# EAGLE design rpi-display-5110 (EAGLE 7.7.0)
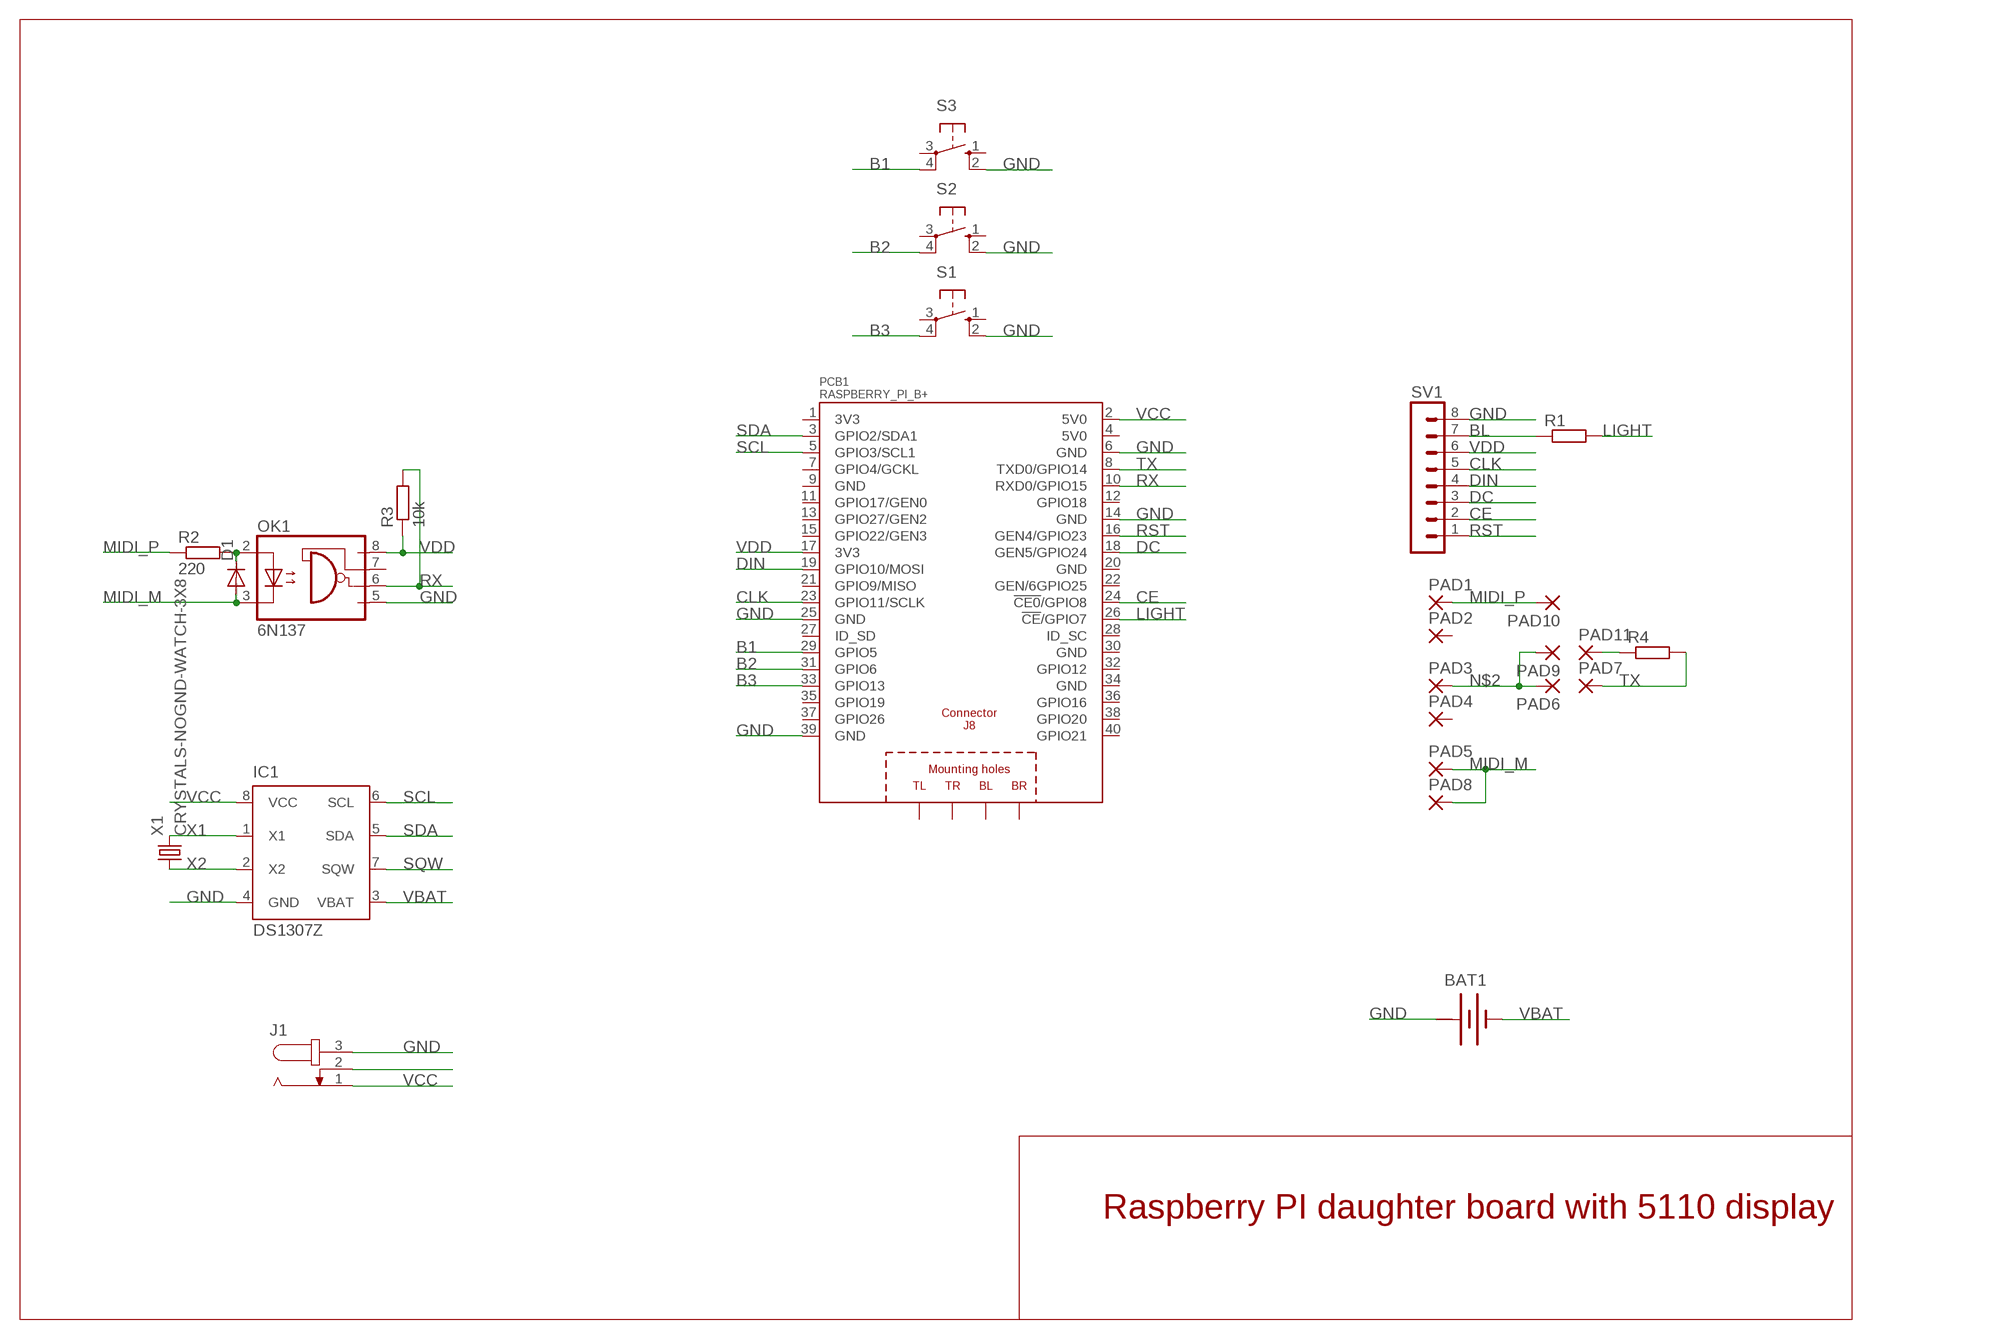
[diagram p0: schematic, sheet 1]

## Parts
BAT1  BATTERY  [BATTERY]
D1  DIODE-MINIMELF  [MINIMELF]
IC1  DS1307Z  [SOIC8]
J1  JACK-PLUG1  [SPC4078]
OK1  6N137  [DIL08]
PAD1  1,6/0,8  [1,6/0,8]
PAD2  1,6/0,8  [1,6/0,8]
PAD3  1,6/0,8  [1,6/0,8]
PAD4  1,6/0,8  [1,6/0,8]
PAD5  1,6/0,8  [1,6/0,8]
PAD6  1,6/0,8  [1,6/0,8]
PAD7  1,6/0,8  [1,6/0,8]
PAD8  1,6/0,8  [1,6/0,8]
PAD9  1,6/0,8  [1,6/0,8]
PAD10  1,6/0,8  [1,6/0,8]
PAD11  1,6/0,8  [1,6/0,8]
PCB1  RASPBERRY_PI_B+  [RASPBERRY_PI_B+]
R1  R-EU_R0805  [R0805]
R2  220  R-EU_R0805  [R0805]
R3  10k  R-EU_R0805  [R0805]
R4  R-EU_R0805  [R0805]
S1  10-XX  [B3F-10XX]
S2  10-XX  [B3F-10XX]
S3  10-XX  [B3F-10XX]
SV1  MA08-1  [MA08-1]
X1  CRYSTALS-NOGND-WATCH-3X8  [WATCH-3X8]

## Nets
B1: PCB1.29(GPIO5) S3.4(P1)
B2: PCB1.31(GPIO6) S2.4(P1)
B3: PCB1.33(GPIO13) S1.4(P1)
BL: R1.1 SV1.7
CE: PCB1.24(!CE0!/GPIO8) SV1.2
CLK: PCB1.23(GPIO11/SCLK) SV1.5
DC: PCB1.18(GEN5/GPIO24) SV1.3
DIN: PCB1.19(GPIO10/MOSI) SV1.4
GND: BAT1.+ IC1.4(GND) J1.3 OK1.5(GND) PCB1.6(GND) PCB1.14(GND) PCB1.25(GND) PCB1.39(GND) S1.2(S1) S2.2(S1) S3.2(S1) SV1.8
LIGHT: PCB1.26(!CE!/GPIO7) R1.2
MIDI_M: D1.A OK1.3(C) PAD5.1(P) PAD8.1(P)
MIDI_P: PAD1.1(P) PAD10.1(P) R2.1
N$1: D1.C OK1.2(A) R2.2
N$2: PAD3.1(P) PAD6.1(P) PAD9.1(P)
N$3: PAD11.1(P) R4.1
N$4: J1.2
RST: PCB1.16(GEN4/GPIO23) SV1.1
RX: OK1.6(VO) PCB1.10(RXD0/GPIO15) R3.2
SCL: IC1.6(SCL) PCB1.5(GPIO3/SCL1)
SDA: IC1.5(SDA) PCB1.3(GPIO2/SDA1)
SQW: IC1.7(SQW)
TX: PAD7.1(P) PCB1.8(TXD0/GPIO14) R4.2
VBAT: BAT1.- IC1.3(VBAT)
VCC: IC1.8(VCC) J1.1 PCB1.2(5V0)
VDD: OK1.8(VCC) PCB1.17(3V3) R3.1 SV1.6
X1: IC1.1(X1) X1.2
X2: IC1.2(X2) X1.1
Unconnected: OK1.7(VE) PAD2.1(P) PAD4.1(P) PCB1.1(3V3) PCB1.4(5V0) PCB1.7(GPIO4/GCKL) PCB1.9(GND) PCB1.11(GPIO17/GEN0) PCB1.12(GPIO18) PCB1.13(GPIO27/GEN2) PCB1.15(GPIO22/GEN3) PCB1.20(GND) PCB1.21(GPIO9/MISO) PCB1.22(GEN/6GPIO25) PCB1.27(ID_SD) PCB1.28(ID_SC) PCB1.30(GND) PCB1.32(GPIO12) PCB1.34(GND) PCB1.35(GPIO19) PCB1.36(GPIO16) PCB1.37(GPIO26) PCB1.38(GPIO20) PCB1.40(GPIO21) PCB1.PE_BL(BL) PCB1.PE_BR(BR) PCB1.PE_TL(TL) PCB1.PE_TR(TR) S1.1(S) S1.3(P) S2.1(S) S2.3(P) S3.1(S) S3.3(P)

## Notes on the sheet
- Raspberry PI daughter board with 5110 display

## Power pins joined to a net without a drawn wire
+: BAT1.+@1(+)

## Library data of the parts
BAT1 = special:BATTERY: BATTERY
D1 = diode:DIODE-: DIODE
IC1 = ds1307_pcf8583:DS1307: I2C-Bus CLOCK/CALENDAR
J1 = con-jack:JACK-PLUG: DC POWER JACK Power Jack, DC, Right Angle, Through Hole, Rated 5A at 16VDC, PC Terminals Distributor: Farnell (www.Farnell.de) Drawing: 84N1161.pdf / 84N1162.pdf Manufacturer: SPC Technology (www.spctechnology.com) Type: SPC4077 / SPC 4078; OC_FARNELL: unknown; OC_NEWARK: unknown
OK1 = optocoupler:6N137: MOTOROLA OPTO COUPLER; MPN: 6N137; OC_FARNELL: 1328376; OC_NEWARK: 52M1895
PAD1-PAD11 = wirepad:1,6/0,8: THROUGH-HOLE PAD
PCB1 = RASPBERRY_PI_Bplus:RASPBERRY_PI_B+: Raspberry Pi B+ Based on issue: Thursday, July 10, 2014 - Rev 1.2 LBR by Tim R. 07-2014
R1-R4 = rcl:R-EU_: RESISTOR, European symbol
S1-S3 = switch-omron:10-XX: OMRON SWITCH; MPN: B3F-1000; OC_FARNELL: 176432; OC_NEWARK: 36M3542
SV1 = con-lstb:MA08-1: PIN HEADER; OC_FARNELL: unknown; OC_NEWARK: unknown
X1 = IQD-Frequency-Products:CRYSTALS-NOGND: CRYSTALS CAN NOT GROUNDED

## Board
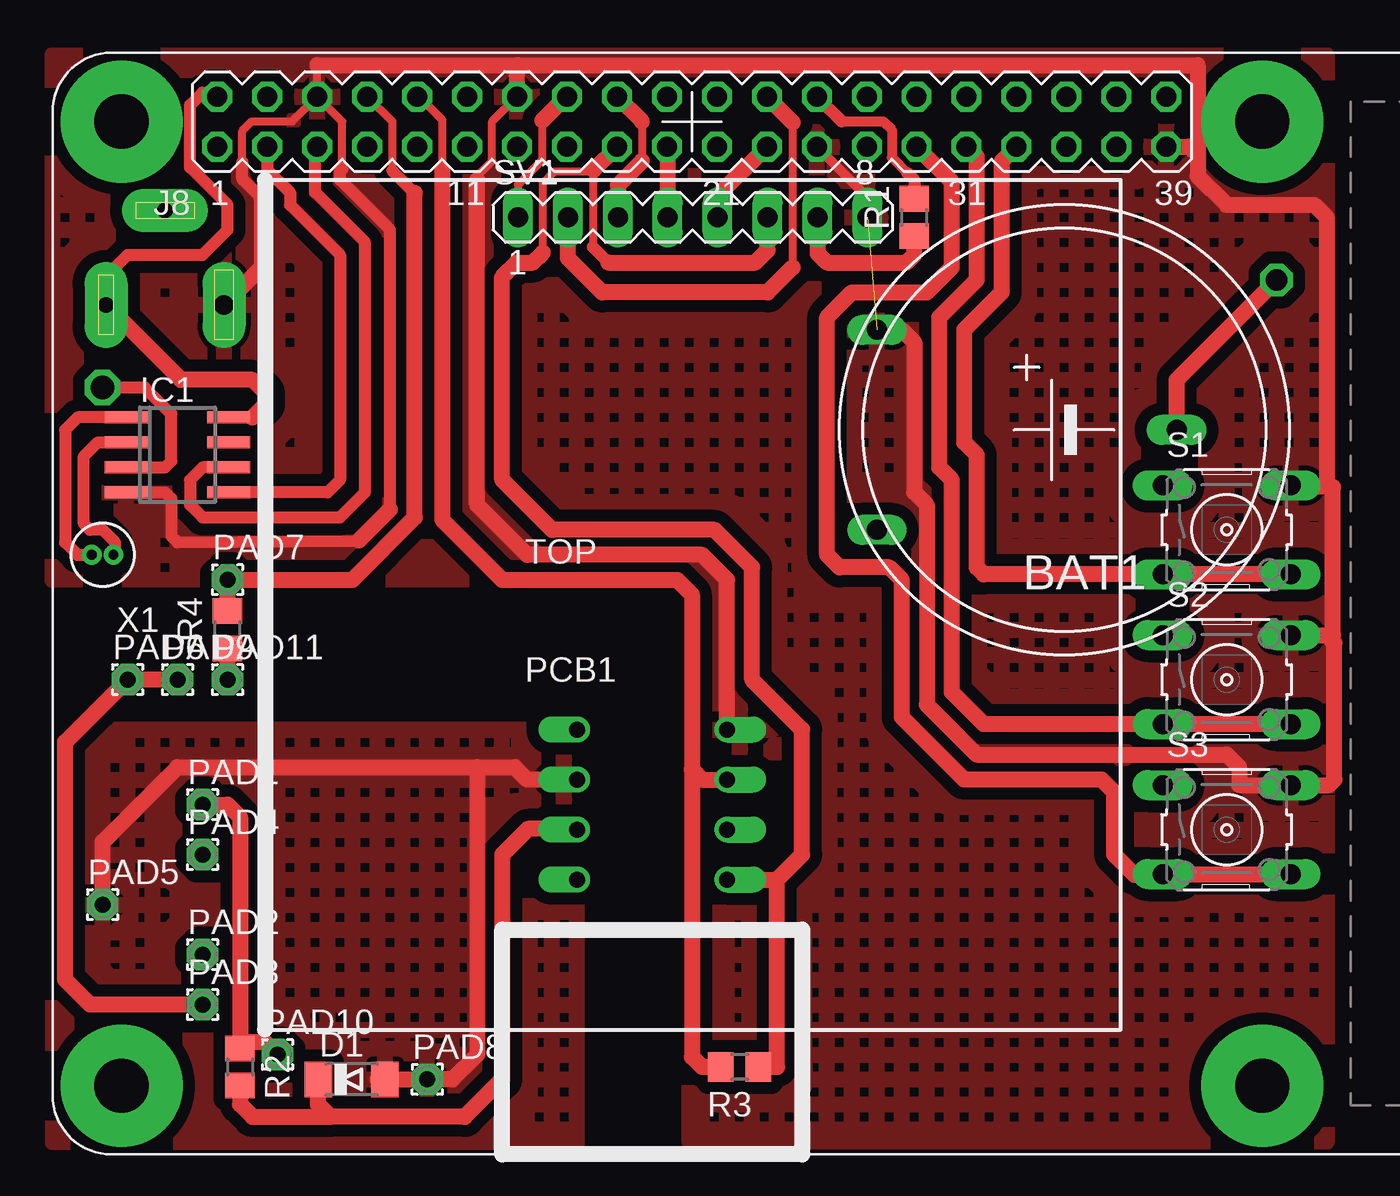
[diagram p1: board, top side]
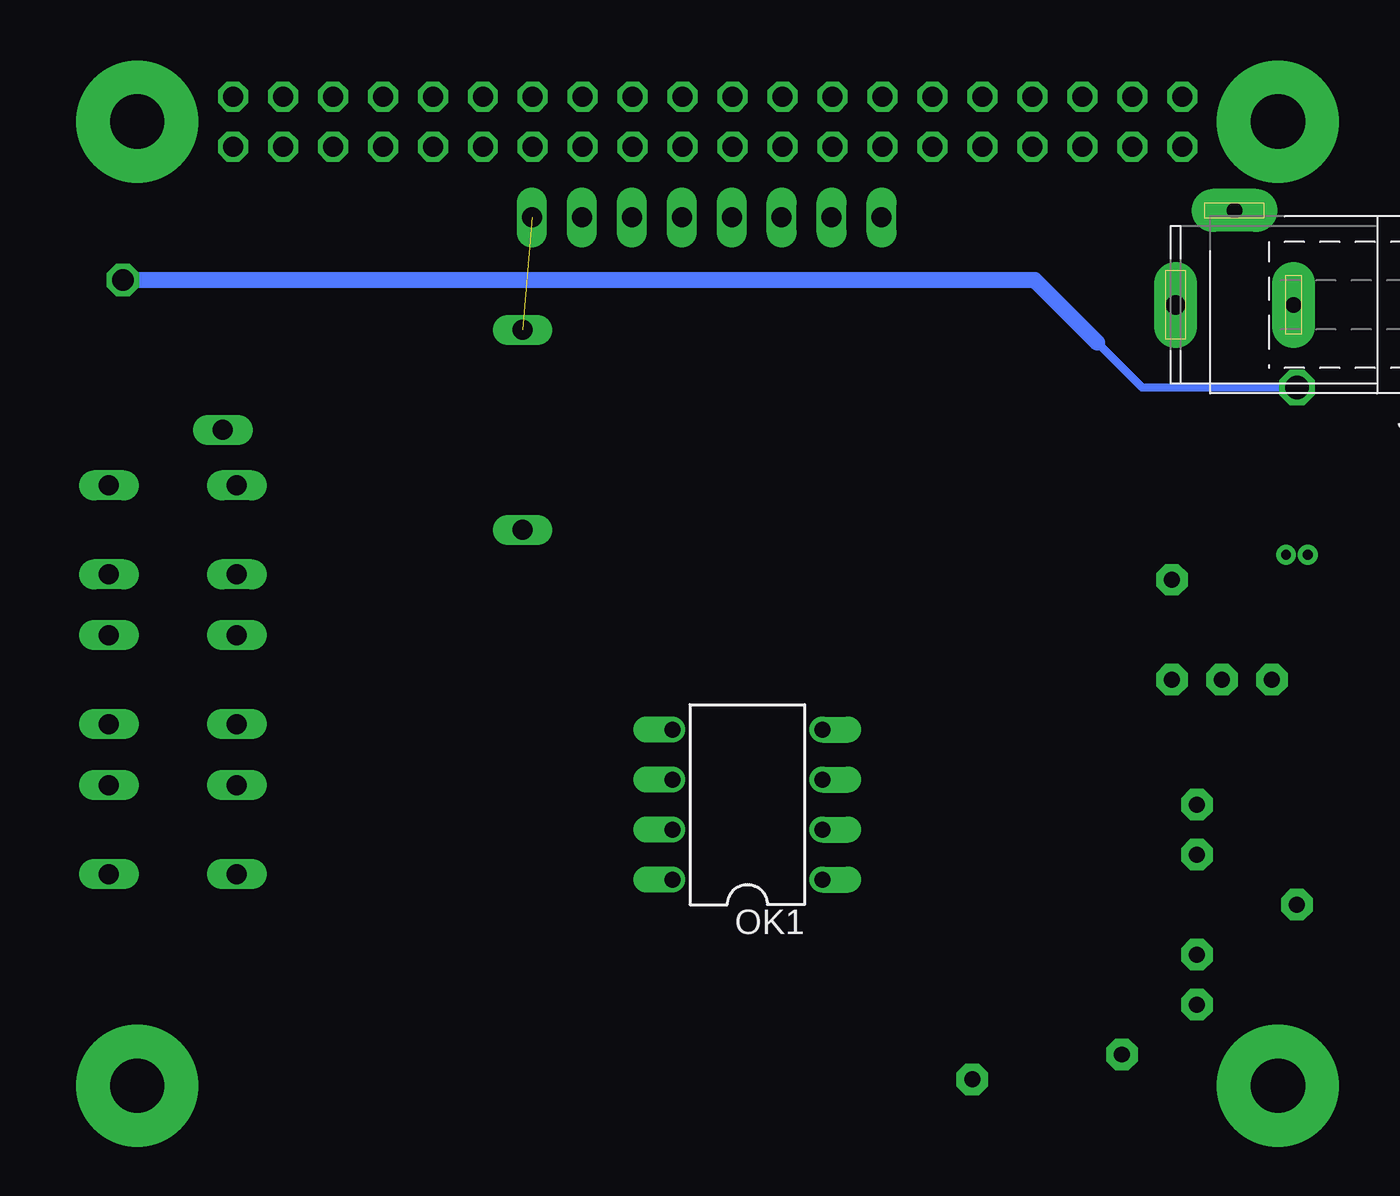
[diagram p2: board, bottom side, seen from below]

No outline drawn. Coordinates in mm, seen from the top.
Copper layers (1*16): Top 0.035mm / dielectric 1.5mm / Bottom 0.035mm
Design rules "default": minimum track width 10mil, minimum drill 24mil, track to track 8mil, track to pad 8mil, pad to pad 8mil, via to via 8mil, smd to smd 8mil, copper to edge 40mil, drill to drill 8mil, minimum pad ring 10mil, minimum via ring 8mil, stop-mask expansion 4mil, vias tented up to drill 0mil, thermal gap 10mil

### Footprints (pad centres in the part's own frame; a part is rotated, then mirrored left to right if it is on the bottom)
BATTERY = drill 1.016 long: + 9.525,-5.08; +@1 9.525,5.08; - -5.715,0
MINIMELF = smd 1.4 x 1.8: A 1.7,0; C -1.7,0
SOIC8 = smd 0.6 x 2.2: 1 -1.905,-2.6; 2 -0.635,-2.6; 3 0.635,-2.6; 4 1.905,-2.6; 5 1.905,2.6; 6 0.635,2.6; 7 -0.635,2.6; 8 -1.905,2.6
SPC4078 = drill 0.8 pad 2.184 long: 1 -3,0; 2 0,-4.8 | drill 1 pad 2.184 long: 3 3,0
DIL08 = drill 0.813 offset: 1 -3.81,-3.81; 2 -1.27,-3.81; 3 1.27,-3.81; 4 3.81,-3.81; 5 3.81,3.81; 6 1.27,3.81; 7 -1.27,3.81; 8 -3.81,3.81
1,6/0,8 = drill 0.813 pad 1.6 octagon: 1 0,0
RASPBERRY_PI_B+ = drill 1.016 octagon: 1 8.37,51.23; 2 8.37,53.77; 3 10.91,51.23; 4 10.91,53.77; 5 13.45,51.23; 6 13.45,53.77; 7 15.99,51.23; 8 15.99,53.77; 9 18.53,51.23; 10 18.53,53.77; 11 21.07,51.23; 12 21.07,53.77; 13 23.61,51.23; 14 23.61,53.77; 15 26.15,51.23; 16 26.15,53.77; 17 28.69,51.23; 18 28.69,53.77; 19 31.23,51.23; 20 31.23,53.77; 21 33.77,51.23; 22 33.77,53.77; 23 36.31,51.23; 24 36.31,53.77; 25 38.85,51.23; 26 38.85,53.77; 27 41.39,51.23; 28 41.39,53.77; 29 43.93,51.23; 30 43.93,53.77; 31 46.47,51.23; 32 46.47,53.77; 33 49.01,51.23; 34 49.01,53.77; 35 51.55,51.23; 36 51.55,53.77; 37 54.09,51.23; 38 54.09,53.77; 39 56.63,51.23; 40 56.63,53.77 | drill 2.75 pad 6.2: PE_BL 3.5,3.5; PE_BR 61.5,3.5; PE_TL 3.5,52.5; PE_TR 61.5,52.5
R0805 = smd 1.3 x 1.5: 1 -0.95,0; 2 0.95,0
B3F-10XX = drill 1.016 long: 1 -3.251,2.261; 2 3.251,2.261; 3 -3.251,-2.261; 4 3.251,-2.261
MA08-1 = drill 1.016 long: 1 -8.89,0; 2 -6.35,0; 3 -3.81,0; 4 -1.27,0; 5 1.27,0; 6 3.81,0; 7 6.35,0; 8 8.89,0
WATCH-3X8 = drill 0.5 pad 0.9: 1 -0.55,0; 2 0.55,0

### Placement (x,y rotation side)
BAT1  51.44,36.83 180 top
D1  15.2,3.81 0 top
IC1  6.35,35.56 270 top
J1  5.71,43.18 180 bottom
OK1  30.48,17.78 90 bottom
PAD1  7.62,17.78 0 top
PAD2  7.62,10.16 0 top
PAD3  7.62,7.62 0 top
PAD4  7.62,15.24 0 top
PAD5  2.54,12.7 0 top
PAD6  3.81,24.13 0 top
PAD7  8.89,29.21 0 top
PAD8  19.05,3.81 0 top
PAD9  6.35,24.13 0 top
PAD10  11.43,5.08 0 top
PAD11  8.89,24.13 0 top
PCB1  0,0 0 top
R1  43.81,47.62 90 top
R2  9.53,4.45 270 top
R3  34.92,4.45 180 top
R4  8.89,26.67 90 top
S1  59.69,31.75 0 top
S2  59.69,24.13 0 top
S3  59.69,16.51 0 top
SV1  32.54,47.62 0 top
X1  2.54,30.48 180 top

### Tracks (layer width: path | path; a pad name or v marks a point on that pad's centre or on a via)
B1
  Top 0.813: PCB1.29 45.72,49.44 45.72,45.09 44.45,43.81 40.64,43.81 39.37,42.55 39.37,30.48 40.01,29.84 42.55,29.84 43.18,29.21 43.18,22.23 46.35,19.05 53.34,19.05 53.98,18.41 53.98,15.24 55.01,14.21 62.19,14.21 62.59,14.6 62.59,14.61 S3.4
B2
  Top 0.813: S2.4 47.35,21.87 45.72,23.5 45.72,34.29 45.09,34.92 45.09,42.55 46.99,44.45 46.99,50.71 PCB1.31
B3
  Top 0.813: S1.4 47.35,29.49 46.99,29.84 46.99,35.56 46.35,36.2 46.35,41.91 48.26,43.81 48.26,50.48 PCB1.33
BL
  Top 0.813: SV1.7 38.89,45.8 39.37,45.32 43.42,45.32 43.81,45.72 R1.1
CE
  Top 0.406: 37.62,52.46 37.62,45.09
  Top 0.813: PCB1.24 37.62,52.46 | 37.62,45.09 36.35,43.81 27.94,43.81 26.19,45.56 SV1.2
CLK
  Top 0.813: PCB1.23 33.81,48.73 SV1.5
DC
  Top 0.406: 29.96,52.51 29.96,50.48
  Top 0.813: PCB1.18 29.95,52.51 29.96,52.51 | 29.96,50.48 28.73,49.25 SV1.3
DIN
  Top 0.813: PCB1.19 31.27,51.19 SV1.4
GND  (1 unrouted)
  Top 0.406: 21.59,49.53 21.59,49.73 22.34,50.48 22.34,52.5 PCB1.14 23.65,55.36 | 14.72,50.09 14.72,52.5 PCB1.6 | PCB1.6 13.45,55.28 13.45,55.36 | 9.64,50.44 9.64,52.03 10.12,52.51 12.19,52.51 PCB1.6
  Top 0.508: SV1.8 41.43,48.65 PCB1.25
  Top 0.61: IC1.4 5.71,33.66 6.03,33.34 6.03,31.43 6.35,31.11 15.56,31.19 | 17.14,32.78 17.14,46.99 14.61,49.53 14.61,49.97 14.72,50.09 | 10.62,48.59 9.68,49.53 9.68,49.57 9.64,49.61 9.64,50.44
  Top 0.813: 13.45,55.36 23.61,55.36 | PCB1.14 23.61,55.36 | 23.61,55.36 23.65,55.36 58.22,55.36 58.22,50.8 | OK1.5 34.29,29.21 33.02,30.48 24.13,30.48 21.59,33.02 21.59,49.53 | PCB1.39 57.79,51.23 58.22,50.8 | 15.56,31.19 17.14,32.78 | BAT1.+ 43.18,41.91 43.81,41.27 43.81,33.66 44.45,33.02 44.45,22.86 46.99,20.32 59.69,20.32 60.33,19.68 60.33,18.77 S3.2 64.89,18.77 65.17,19.05 65.17,25.99 64.77,26.39 | S2.2 64.77,26.39 | 64.77,26.39 65.09,26.39 65.09,33.93 64.77,33.93 | 64.77,33.93 63.02,33.93 S1.2 | 58.22,50.8 58.22,49.73 59.69,48.26 64.14,48.26 64.77,47.62 64.77,33.93 | 10.62,48.59 10.62,45.09 J1.3
  pour Top (isolate 0.61, hatched): 0,55.88 64.77,55.88 64.77,0.64 32.38,0.64 32.38,1.27 32.38,29.21 0,29.21
LIGHT
  Top 0.508: 40.12,52.51 42.23,52.51 42.66,52.07 42.66,50.68 43.5,49.85
  Top 0.61: PCB1.26 40.12,52.51 | 43.46,49.89 43.5,49.85 43.81,49.53 R1.2
MIDI_M
  Top 0.813: OK1.3 24.13,19.05 23.5,19.68 21.59,19.68 | 21.59,19.68 21.59,5.08 20.32,3.81 PAD8.1 16.51,3.81 | PAD5.1 2.54,15.88 6.35,19.68 21.59,19.68
  pour Top (isolate 0.61, hatched): 0,0.64 26.67,0.64 26.67,21.59 0,21.59
MIDI_P
  Top 0.813: PAD1.1 8.89,17.78 9.53,17.14 R2.1 9.85,5.71 10.79,5.71 PAD10.1
N$1
  Top 0.813: OK1.2 26.63,16.55 24.17,16.55 22.86,15.24 22.86,3.81 20.95,1.91 14.13,1.91 14.05,1.98 | 14.05,1.98 13.49,2.54 D1.C | R2.2 9.53,2.54 10.16,1.91 13.97,1.91 14.05,1.98
N$2
  Top 0.813: PAD9.1 PAD6.1 0.64,20.95 0.64,8.89 1.91,7.62 PAD3.1
N$3
  Top 0.813: PAD11.1 R4.1
RST
  Top 0.406: 24.88,52.55 24.88,50.52 23.65,49.29 SV1.1
  Top 0.813: PCB1.16 26.11,53.77 24.88,52.55
RX
  Top 0.406: PCB1.10 18.62,53.77 19.8,52.59 19.8,50.01
  Top 0.813: 32.5,19.57 33.02,19.05 OK1.6 | 32.5,19.57 32.5,4.96 33.02,4.45 R3.2 | 19.8,50.01 19.8,32.27 22.86,29.21 31.75,29.21 32.5,28.46 32.5,19.57
SCL
  Top 0.61: IC1.6 7.62,34.92 6.99,34.29 6.99,33.02 7.62,32.38 14.61,32.38 15.88,33.66 15.88,46.35 13.34,48.9 13.34,51.12 PCB1.5
SDA
  Top 0.61: PCB1.3 10.91,50.05 12.06,48.9 12.06,48.26 14.61,45.72 14.61,34.29 13.97,33.66 IC1.5
TX
  Top 0.406: PCB1.8 16,53.77 17.26,52.51 17.26,50.01
  Top 0.61: 18.41,48.85 17.26,50.01
  Top 0.813: 18.41,48.85 18.41,32.38 15.24,29.21 PAD7.1 R4.2
VBAT  (via drill 1.1, 1.2)
  Top 0.61: IC1.3 5.71,34.92 6.03,35.24 6.03,37.62 4.68,38.97 v2.54,38.97
  Top 0.813: BAT1.- 57.15,39.37 v62.23,44.45
  Bottom 0.406: v2.54,38.97 10.4,38.97 12.7,41.27
  Bottom 0.813: v62.23,44.45 15.88,44.45 12.7,41.27
VCC
  Top 0.61: IC1.8 10.16,37.47 | 10.79,38.1 10.79,38.73 | J1.1 2.71,44.62 3.81,45.72 7.62,45.72 8.89,46.99 8.89,48.26 6.99,50.16 6.99,53.34 7.62,53.98 8.16,53.98 PCB1.2
  Top 0.813: 10.16,37.47 10.79,38.1 | 10.79,38.73 10.16,39.37 6.53,39.37 J1.1
VDD
  Top 0.406: 27.5,50.05 27.46,50.01 | 27.46,50.01 27.46,46.12 | 24.92,45.84 24.92,49.37 25.52,49.97 27.42,49.97 27.46,50.01
  Top 0.61: 27.46,46.12 28.26,45.32
  Top 0.813: PCB1.17 27.51,50.05 27.5,50.05 | 28.26,45.32 35.72,45.32 36.35,45.96 SV1.6 | OK1.8 36.83,13.97 | 24.92,45.84 24.41,45.32 23.57,45.32 22.86,44.61 22.86,34.29 25.4,31.75 33.66,31.75 35.56,29.84 35.56,24.13 38.1,21.59 38.1,15.24 36.83,13.97 | R3.1 36.83,4.45 36.83,13.97
X1
  Top 0.406: 1.91,30.57 X1.2
  Top 0.61: IC1.1 1.27,37.47 0.64,36.83 0.64,31.11 1.27,30.48 X1.2
X2
  Top 0.406: 3.17,30.57 X1.1
  Top 0.61: 3.17,30.57 3.17,31.11 2.54,31.75 1.91,31.75 1.59,32.07 1.59,35.48 2.3,36.2 IC1.2